# Altium schematic sheet E17-04-CONTACTOR_CONTROL.SchDoc
size A; DocumentNumber: 2; SheetNumber: 2; SheetTotal: 18
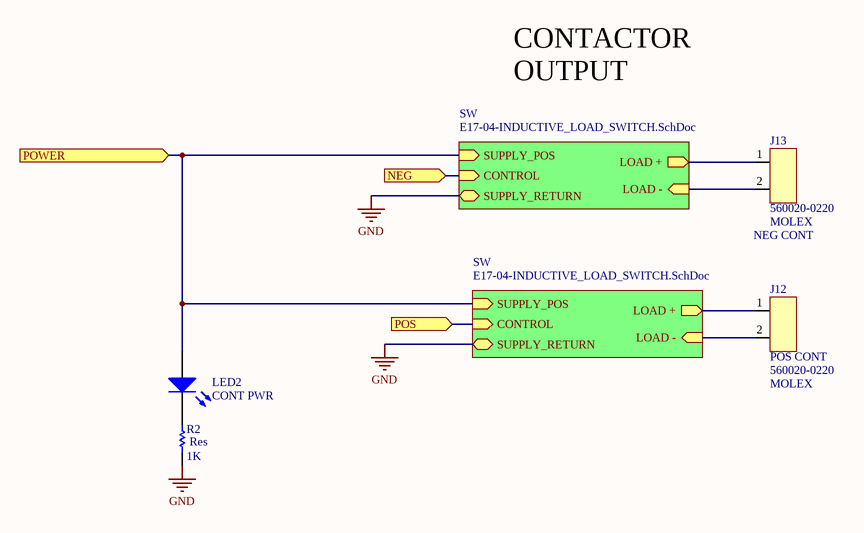
[diagram p0: E17-04-CONTACTOR_CONTROL.SchDoc]

## Parts
J12  POS CONT  MANUFACTURER: MOLEX  [MOLEX_DURACLIK_2 NAT VERT]
J13  NEG CONT  MANUFACTURER: MOLEX  [MOLEX_DURACLIK_2 NAT VERT]
LED2  CONT PWR  [155124VS73200]
R2  Res  value 1K  [2012[0805]]

## Sub-sheets
SW = E17-04-INDUCTIVE_LOAD_SWITCH.SchDoc: CONTROL (in), LOAD + (out), SUPPLY_POS (in), LOAD - (in), SUPPLY_RETURN
SW = E17-04-INDUCTIVE_LOAD_SWITCH.SchDoc: CONTROL (in), LOAD + (out), SUPPLY_POS (in), LOAD - (in), SUPPLY_RETURN

## Ports
NEG (in), POS (in), POWER (in)

## Nets
GND: R2.1 ; sheet SW/SUPPLY_RETURN, sheet SW/SUPPLY_RETURN
NEG: port NEG, sheet SW/CONTROL
POS: port POS, sheet SW/CONTROL
POWER: LED2.2 ; port POWER, sheet SW/SUPPLY_POS, sheet SW/SUPPLY_POS
NetJ12_1: J12.1 ; sheet SW/LOAD +
NetJ12_2: J12.2 ; sheet SW/LOAD -
NetJ13_1: J13.1 ; sheet SW/LOAD +
NetJ13_2: J13.2 ; sheet SW/LOAD -
NetLED2_1: LED2.1 R2.2

## Notes on the sheet
- CONTACTOR
  OUTPUT

## Library data of the parts
J12 J13 = 560020-0220: MOLEX DURACLIK 2-PIN VERT NAT; POSITIONS: 2; UL: 94V-0; VOLTAGE: 125; CURRENT: 3; PLATING: Tin (Sn); Digikey_PN: Not in production; COLOR: NAT; SERIES: Duraclik; ORIENTATOIN: VERT; MPN: 560020-0220; Comment_1: 560020-0220
LED2 = 155124VS73200: Right Angle SMD Green 2V; Manufacturer: Wurth Electronics Inc; Lens Color: Colorless; Lens Transparency: Clear; Millicandela Rating: 50mcd; Lens Style/Size: Rectangle with Domed Top, 2.00mm x 1.00mm; Current - Test: 20mA; Viewing Angle: 120°; Wavelength - Dominant: 573nm; Wavelength - Peak: 575nm; Supplier 1: Digi-Key; Supplier Part Number 1: 732-5026-1-ND; RoHS: RoHS Compliant; Category: Optoelectronics; Stock 1: 4820; Pricing 1: 1=0.44, 50=0.3802, 100=0.3476, 500=0.31498, 1000=0.29326 (CAD); Packaging: Cut Tape (CT); Color: Green; Voltage - Forward (Vf) (Typ): 2V; Mounting Type: Surface Mount, Right Angle; Features: -; Package / Case: 2-SMD, Side View; Supplier Device Package: 1204; Size / Dimension: 3.20mm L x 1.50mm W; Height (Max): 1.20mm; ComponentLink1URL: http://katalog.we-online.de/led/datasheet/155124VS73200.pdf; ComponentLink1Description: http://katalog.we-online.de/led/datasheet/155124VS73200.pdf; Manufacturer Part Number: 155124VS73200
R2 = Res: Surface Mount Resistor; Published: 8-Jun-2000; LatestRevisionDate: 17-Jul-2002; LatestRevisionNote: Re-released for DXP Platform.; PackageReference: AXIAL-0.5; Publisher: Altium Limited